# EAGLE schematic firing-motor (EAGLE 7.2.0)
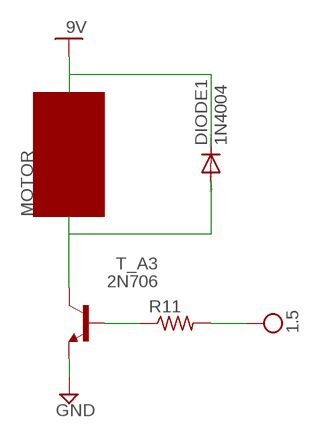
[diagram p0: schematic, sheet 1]

## Parts
DIODE1  1N4004  [DO41-10]
R11  R-US_0204/2V  [0204V]
T_A3  2N706  [TO18]

## Nets
GND: DIODE1.C T_A3.1(E) ; supply symbol labelled 9V
N$23: DIODE1.A T_A3.3(C)
N$24: R11.1 T_A3.2(B)
VCC: R11.2 ; supply symbol labelled 1.5

## Notes on the sheet
- MOTOR

## Library data of the parts
DIODE1 = diode:1N4004: DIODE general purpose rectifier, 1 A
R11 = rcl:R-US_: RESISTOR, American symbol
T_A3 = transistor:2N706: NPN TRANSISTOR